# Altium schematic sheet Actuators Motors.SchDoc
size A3; Address1: ECE Department; Address2: University of Canterbury; Address3: Christchurch 8041; Address4: New Zealand; Revision: 1
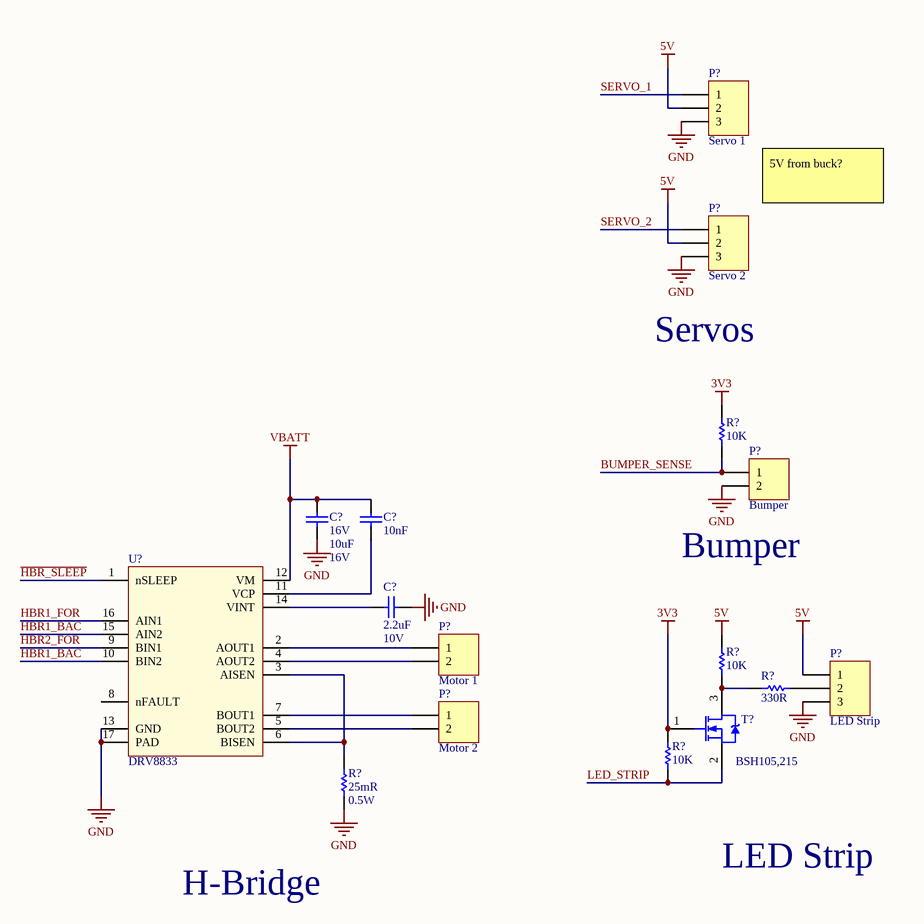
[diagram p0: Actuators Motors.SchDoc]

## Parts
(Parts that share a designator on the sheet are numbered #1, #2 ... from top to bottom, then left to right.)
C?#1  Voltage - Rated: 16V  [CAPC2012L]  (hidden comment: 10uF)
C?#2  10nF  [CAPC1608L]
C?#3  Max Voltage: 10V  [CAPC1608L]  (hidden comment: 2.2uF)
P?#1  Servo 1  [MHDR1X3]
P?#2  Servo 2  [MHDR1X3]
P?#3  Bumper  [MHDR1X2]
P?#4  Motor 1  [MHDR1X2]
P?#5  LED Strip  [MHDR1X3]
P?#6  Motor 2  [MHDR1X2]
R?#1  10K  [RESC1608L]
R?#2  10K  [RESC1608L]
R?#3  330R  [RESC1608L]
R?#4  10K  [RESC1608L]
R?#5  25mR  Power: 0.5W  [RESC3216N]
T?  BSH105,215  [SOT23_L]
U?  DRV8833  [HTSOP16]

## Nets
3V3: R?#1.2 R?#4.2 T?.1
5V: P?#1.2 P?#2.2 P?#5.1 R?#2.2
GND: C?#1.1 C?#3.2 P?#1.3 P?#2.3 P?#3.2 P?#5.3 R?#5.1 U?.13(GND) U?.17(PAD)
VBATT: C?#1.2 C?#2.2 U?.12(VM)
~{HBR_SLEEP}: U?.1(nSLEEP)
BUMPER_SENSE: P?#3.1 R?#1.1
HBR1_BAC: U?.10(BIN2) U?.15(AIN2)
HBR1_FOR: U?.16(AIN1)
HBR2_FOR: U?.9(BIN1)
LED_STRIP: R?#4.1 T?.2
SERVO_1: P?#1.1
SERVO_2: P?#2.1
NetC?#2_1: C?#2.1 U?.11(VCP)
NetC?#3_1: C?#3.1 U?.14(VINT)
NetP?#4_1: P?#4.1 U?.2(AOUT1)
NetP?#4_2: P?#4.2 U?.4(AOUT2)
NetP?#5_2: P?#5.2 R?#3.2
NetP?#6_1: P?#6.1 U?.7(BOUT1)
NetP?#6_2: P?#6.2 U?.5(BOUT2)
NetR?#2_1: R?#2.1 R?#3.1 T?.3
NetR?#5_2: R?#5.2 U?.3(AISEN) U?.6(BISEN)

Not connected (* = marked no-connect by the designer): U? 8(nFAULT)

## Notes on the sheet
- 5V from buck?
- Servos
- (near P?#3) Bumper
- H-Bridge
- LED Strip
- Title
- Drawn by:
- Date:
- Time:
- Revision:
- Sheet
- of
- File:

## Library data of the parts
C?#1 = CC_10uF_16V_0805: CAP CER 10uF X5R 16V 0805; Manufacturer: Samsung Electro-Mechanics; Manufacturer Part Number: CL21A106KOQNNWE; Note: Footprint corresponds to dimensions for bulk cassette packaging. This case size has tightened tolerances.; Tolerance: ±10%; Notification: Current market demand for these product types have resulted in fluctuating and extending lead times. Lead times may differ.; PackageReference: 0805; Code_IPC: 2012[0805]; Supplier 1: Digi-Key; RoHS: RoHS Compliant; Category: Capacitors; Stock 1: 20000; Pricing 1: 1=0.35, 10=0.25, 100=0.1178, 500=0.08254, 1000=0.06831 (NZD); Packaging: Cut Tape (CT); Part Status: Active; Temperature Coefficient: X5R; Operating Temperature: -55°C ~ 85°C; Features: -; Ratings: -; Applications: General Purpose; Mounting Type: Surface Mount, MLCC; Package / Case: 0805 (2012 Metric); Size / Dimension: 0.079" L x 0.049" W (2.00mm x 1.25mm); Height - Seated (Max): -; Thickness (Max): 0.055" (1.40mm); Lead Spacing: -; Lead Style: -; ComponentLink1URL: http://www.samsungsem.com/kr/support/product-search/mlcc/CL21A106KOQNNWE.jsp; ComponentLink1Description: http://www.samsungsem.com/kr/support/product-search/mlcc/CL21A106KOQNNWE.jsp; Supplier Part Number 1: 1276-2894-1-ND; Value: 10uF; Max Voltage: 16V
C?#2 = CC_10nF_0603: CAP CER 10nF X7R +-10% 50V 0603; PackageReference: 0603; Code_IPC: 1608 [0603]; Verify: *; Supplier: ECE Dept; Storage Location: PCB Assembly WS; Value: 10nF
C?#3 = CC_2.2uF_0603: CAP CER 2.2uF X5R +-20% 10V 0603; PackageReference: 0603; Code_IPC: 1608 [0603]; Verify: *; Supplier: ECE Dept; Storage Location: PCB Assembly WS; Value: 2.2uF
P?#1 P?#2 P?#5 = MHDR1X3: Header, 3-Pin; LatestRevisionDate: 17-Jul-2002; LatestRevisionNote: Re-released for DXP Platform.; Publisher: Altium Limited
P?#3 P?#4 P?#6 = MHDR1X2: Header, 2-Pin; LatestRevisionDate: 17-Jul-2002; LatestRevisionNote: Re-released for DXP Platform.; Publisher: Altium Limited
R?#1 R?#2 R?#4 = RS_10K: RES 10.0K OHM 1/10W 5% 0603 SMD; Storage Location: PCB Assembly WS; Supplier: ECE Dept; Value: 10K
R?#3 = RS_330R: RES 330 OHM 1/10W 5% 0603 SMD; Storage Location: PCB Assembly WS; Supplier: ECE Dept; Value: 330R
R?#5 = RS_25mR: 0.5W 1206 25mR Resistor
T? = TM_BSH105: MOSFET N-CH 20V 1.05A SOT-23; Manufacturer: NXP Semiconductors; FET Type: MOSFET N-Channel, Metal Oxide; Gate Charge (Qg) @ Vgs: 3.9nC @ 4.5V; Input Capacitance (Ciss) @ Vds: 152pF @ 16V; Power - Max: 417mW; Rds On (Max) @ Id, Vgs: 200 mOhm @ 600mA, 4.5V; Supplier 1: Farnell; Supplier 2: Digi-Key; Current - Continuous Drain (Id) @ 25° C: 1.05A; Drain to Source Voltage (Vdss): 20V; Package / Case: TO-236-3, SC-59, SOT-23-3; Pricing: 1=0.53, 10=0.42, 25=0.3544, 100=0.2885, 250=0.23896, 500=0.1974, 1000=0.14785 (NZD); Supplier Part Number 1: 1758066; Supplier Part Number 2: 568-6215-1-ND; Storage Location: PCB Assembly WS; Supplier: ECE Dept; Manufacturer Part Number: BSH105,215
U? = DRV8833: Dual H-Bridge Motor Driver 1.5A